# EasyEDA Pro project ProPrj_STC-FOC驱动_2026-02-01.epro

# Schematic Schematic1
Board Name: Board1; Create Date: 2026-01-31; Page Name: P1; Project Name: STC-FOC驱动; Schematic Name: Schematic1; Update Date: 2026-01-31; Company: 嘉立创EDA; Page Size: A4; Version: V1.0
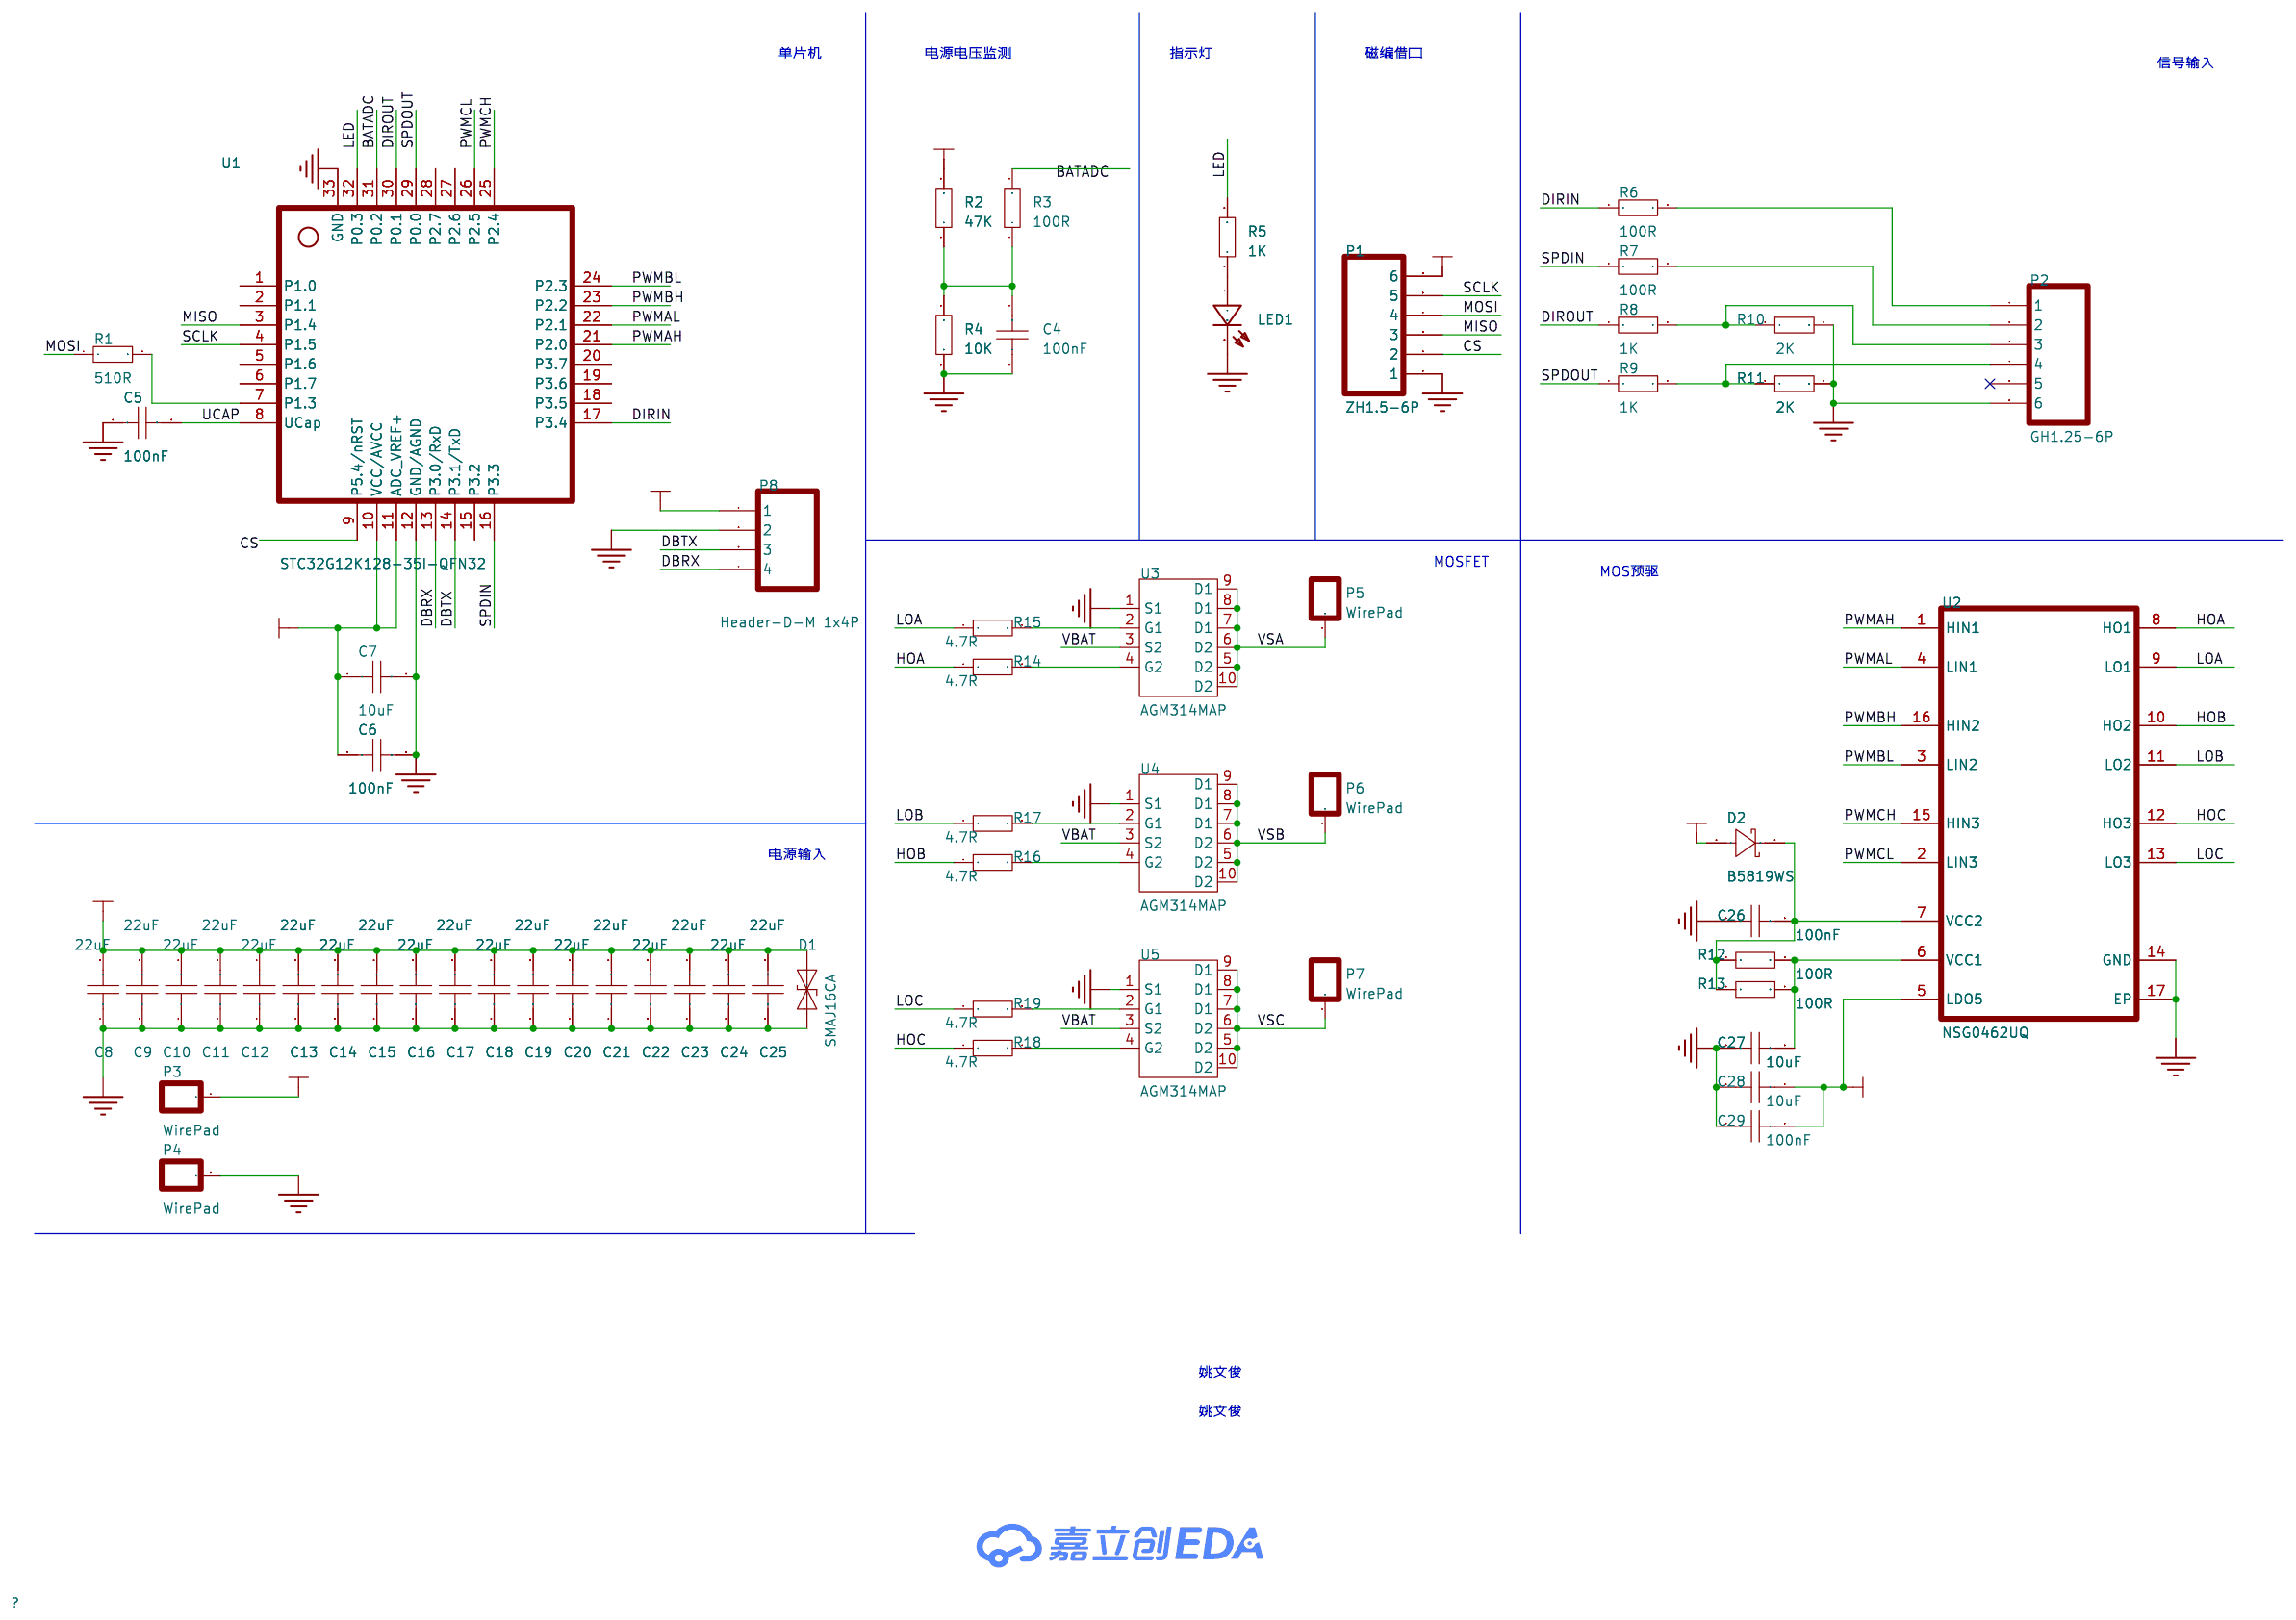
[diagram p0: schematic sheet]

## Parts
C4  100nF  [C0402]
C5  100nF  [C0402]
C6  100nF  [C0402]
C7  10uF  [C0603]
C8  22uF  [C0805]
C9  22uF  [C0805]
C10  22uF  [C0805]
C11  22uF  [C0805]
C12  22uF  [C0805]
C13  22uF  [C0805]
C14  22uF  [C0805]
C15  22uF  [C0805]
C16  22uF  [C0805]
C17  22uF  [C0805]
C18  22uF  [C0805]
C19  22uF  [C0805]
C20  22uF  [C0805]
C21  22uF  [C0805]
C22  22uF  [C0805]
C23  22uF  [C0805]
C24  22uF  [C0805]
C25  22uF  [C0805]
C26  100nF  [C0603]
C27  10uF  [C0603]
C28  10uF  [C0603]
C29  100nF  [C0402]
D1  SMAJ16CA  [SMA_L4.4-W2.6-LS5.0-BI]
D2  B5819WS  [SOD-323_L1.7-W1.3-LS2.7-RD]
LED1  LED Chip Blue  [LEDC1608(0603)-L]
P1  ZH1.5-6P  [ZH1.5-6P-SH]
P2  GH1.25-6P  [GH1.25-6P-SH]
P3  WirePad  [WirePad-3x4]
P4  WirePad  [WirePad-3x4]
P5  WirePad  [WirePad-3x4]
P6  WirePad  [WirePad-3x4]
P7  WirePad  [WirePad-3x4]
P8  Header-D-M 1x4P  [HDR1X4-M]
R1  510R  [R0402]
R2  47K  [R0402]
R3  100R  [R0402]
R4  10K  [R0402]
R5  1K  [R0402]
R6  100R  [R0402]
R7  100R  [R0402]
R8  1K  [R0402]
R9  1K  [R0402]
R10  2K  [R0402]
R11  2K  [R0402]
R12  100R  [R0603]
R13  100R  [R0603]
R14  4.7R  [R0402]
R15  4.7R  [R0402]
R16  4.7R  [R0402]
R17  4.7R  [R0402]
R18  4.7R  [R0402]
R19  4.7R  [R0402]
U1  STC32G12K128-35I-QFN32  [QFN32-4x4]
U2  NSG0462UQ  [QFN16-3x3-0.5]
U3  AGM314MAP  [PDFN-8_L3.2-W3.1-P0.65-LS3.4-BL-EP2]
U4  AGM314MAP  [PDFN-8_L3.2-W3.1-P0.65-LS3.4-BL-EP2]
U5  AGM314MAP  [PDFN-8_L3.2-W3.1-P0.65-LS3.4-BL-EP2]

## Library data of the parts
C4-C6 C29 = CAP_0402: Supplier Footprint: 0402
C7 C26-C28 = CAP_0603: Supplier Footprint: 0603
C8-C25 = CAP_0805: Supplier Footprint: 0805
D1 = SMAJ16CA: 极性:双向;反向截止电压(Vrwm):16V;钳位电压:26V;峰值脉冲电流(Ipp):15.38A;峰值脉冲功率(Ppp):400W@10/1000us;击穿电压:17.8V;; LCSC Part Name: 双向TVS 16V截止 峰值脉冲电流：15.38A; Supplier Part: C356365; Manufacturer: DOWO(东沃); Supplier Footprint: SMA(DO-214AC); JLCPCB Part Class: 扩展库; Datasheet: https://item.szlcsc.com/datasheet/SMAJ16CA/331563.html; Supplier: LCSC; Polarity: 双向; Reverse Stand-Off Voltage (Vrwm): 16V; Clamping Voltage: 26V; Peak Pulse Current (Ipp): 15.38A; Peak Pulse Power Dissipation (Ppp): 400W@10/1000us; Voltage - Breakdown: 17.8V; Reverse Leakage Current (Ir): 1uA; Operating Temperature: -55℃~+150℃; Type: TVS
D2 = B5819WS_C51953485: 二极管配置:1个独立式;正向压降(Vf):900mV@3A;直流反向耐压(Vr):40V;整流电流:1A;; LCSC Part Name: B5819WS 肖特基二极管 丝印SL 电流：1A 耐压：40V; Supplier Part: C51953485; Manufacturer: CCX(晁禾); Supplier Footprint: SOD-323; JLCPCB Part Class: 扩展库; Datasheet: https://item.szlcsc.com/datasheet/B5819WS/54682195.html; Supplier: LCSC; Diode Configuration: 1个独立式; Voltage - Forward(Vf@If): 900mV@3A; Voltage - DC Reverse(Vr): 40V; Current - Rectified: 1A; Reverse Leakage Current (Ir): 1mA@40V; Non-Repetitive Peak Forward Surge Current: 9A
LED1 = LED Chip Blue: 蓝色贴片LED; Published: 8-Jun-2000; Revision: July-2002: Re-released for DXP Platform.; Publisher: Altium Limited; Price(RMB): 0.00; Color: Blue; Footprint Name: LEDC3528-2
P1 = ZH1.5-6P: Revision: V1.0; Footprint Name: ZH1.5-6P-DV
P2 = GH1.25-6P: Revision: V1.0; Footprint Name: GH1.25-6P-SV
P3-P7 = WirePad: 线缆焊盘
P8 = Header-D-M 1x4P: 1x4pin, 直插, 排针; Revision: V1.0
R1-R11 R14-R19 = Res_0402: Supplier Footprint: 0402
R12 R13 = Res_0603: Supplier Footprint: 0603
U1 = STC32G12K128-35I-QFN32
U2 = NSG0462UQ: NSG0462UQ 三相栅极驱动器
U3-U5 = AGM314MAP: 数量:1个N沟道+1个P沟道;漏源电压(Vdss):30V;连续漏极电流(Id):30A；20A;导通电阻(RDS(on)):10mΩ@10V；18.5mΩ@10V;耗散功率(Pd):29.7W;阈值电压(Vgs(th)):1.6V@250uA；1.5V@250uA;; LCSC Part Name: 1个N沟道+1个P沟道 耐压:30V 电流:30A; Supplier Part: C17701056; Manufacturer: AGMSEMI(芯控源); Supplier Footprint: PDFN3.3x3.3-8; JLCPCB Part Class: 扩展库; Datasheet: https://item.szlcsc.com/datasheet/AGM314MAP/18831720.html; Supplier: LCSC; Number: 1个N沟道+1个P沟道; Drain to Source Voltage: 30V; Current - Continuous Drain(Id): 30A；20A; RDS(on): 10mΩ@10V；18.5mΩ@10V; Pd - Power Dissipation: 29.7W; Gate Threshold Voltage (Vgs(th)): 1.6V@250uA；1.5V@250uA; Gate Charge(Qg): 11.7nC@10V；13.2nC@10V; Input Capacitance(Ciss): 623pF；750pF; Reverse Transfer Capacitance (Crss@Vds): 91pF；117pF; Operating Temperature: -55℃~+150℃; Type: N沟道+P沟道; Output Capacitance(Coss): 102pF；188pF

## Nets
GND: C4.1 C5.1 C6.2 C7.2 C8.1 C9.1 C10.1 C11.1 C12.1 C13.1 C14.1 C15.1 C16.1 C17.1 C18.1 C19.1 C20.1 C21.1 C22.1 C23.1 C24.1 C25.1 C26.1 C27.1 C28.1 C29.1 D1.2(A) LED1.C P1.1 P2.6 P4.1 P8.2 R4.1 R10.2 R11.2 U1.12(GND/AGND) U1.33(GND) U2.14(GND) U2.17(EP) U3.1(S1) U4.1(S1) U5.1(S1)
VBAT: C8.2 C9.2 C10.2 C11.2 C12.2 C13.2 C14.2 C15.2 C16.2 C17.2 C18.2 C19.2 C20.2 C21.2 C22.2 C23.2 C24.2 C25.2 D1.1(K) D2.2(A) P3.1 R2.2 U3.3(S2) U4.3(S2) U5.3(S2)
VCCMCU: C6.1 C7.1 C28.2 C29.2 P1.6 P8.1 U1.10(VCC/AVCC) U1.11(ADC_VREF+) U2.5(LDO5)
BATADC: R3.2 U1.31(P0.2)
CS: P1.2 U1.9(P5.4/nRST)
DBRX: P8.4 U1.13(P3.0/RxD)
DBTX: P8.3 U1.14(P3.1/TxD)
DIRIN: R6.1 U1.17(P3.4)
DIROUT: R8.1 U1.30(P0.1)
HOA: R14.1 U2.8(HO1)
HOB: R16.1 U2.10(HO2)
HOC: R18.1 U2.12(HO3)
LED: R5.2 U1.32(P0.3)
LOA: R15.1 U2.9(LO1)
LOB: R17.1 U2.11(LO2)
LOC: R19.1 U2.13(LO3)
MISO: P1.3 U1.3(P1.4)
MOSI: P1.4 R1.1
PWMAH: U1.21(P2.0) U2.1(HIN1)
PWMAL: U1.22(P2.1) U2.4(LIN1)
PWMBH: U1.23(P2.2) U2.16(HIN2)
PWMBL: U1.24(P2.3) U2.3(LIN2)
PWMCH: U1.25(P2.4) U2.15(HIN3)
PWMCL: U1.26(P2.5) U2.2(LIN3)
SCLK: P1.5 U1.4(P1.5)
SPDIN: R7.1 U1.16(P3.3)
SPDOUT: R9.1 U1.29(P0.0)
UCAP: C5.2 U1.8(UCap)
VSA: P5.1 U3.5(D2) U3.6(D2) U3.7(D1) U3.8(D1) U3.9(D1) U3.10(D2)
VSB: P6.1 U4.5(D2) U4.6(D2) U4.7(D1) U4.8(D1) U4.9(D1) U4.10(D2)
VSC: P7.1 U5.5(D2) U5.6(D2) U5.7(D1) U5.8(D1) U5.9(D1) U5.10(D2)
$1N1197: R1.2 U1.7(P1.3)
$1N1744: C4.2 R2.1 R3.1 R4.2
$1N1936: LED1.A R5.1
$1N2404: P2.4 R9.2 R11.1
$1N2432: P2.3 R8.2 R10.1
$1N2453: P2.2 R7.2
$1N2459: P2.1 R6.2
$1N3795: C27.2 R12.2 R13.2 U2.6(VCC1)
$1N3801: C26.2 D2.1(K) R12.1 R13.1 U2.7(VCC2)
$1N6274: R15.2 U3.2(G1)
$1N6279: R14.2 U3.4(G2)
$1N6795: R17.2 U4.2(G1)
$1N6797: R16.2 U4.4(G2)
$1N6966: R19.2 U5.2(G1)
$1N6968: R18.2 U5.4(G2)

Not connected (* = marked no-connect by the designer): P2 5*; U1 1(P1.0) 2(P1.1) 5(P1.6) 6(P1.7) 15(P3.2) 18(P3.5) 19(P3.6) 20(P3.7) 27(P2.6) 28(P2.7)

## Notes on the sheet
- 单片机
- 电源电压监测
- 指示灯
- 磁编借口
- 信号输入
- MOSFET
- MOS预驱
- 电源输入
- 姚文俊
- 姚文俊

# Board PCB1
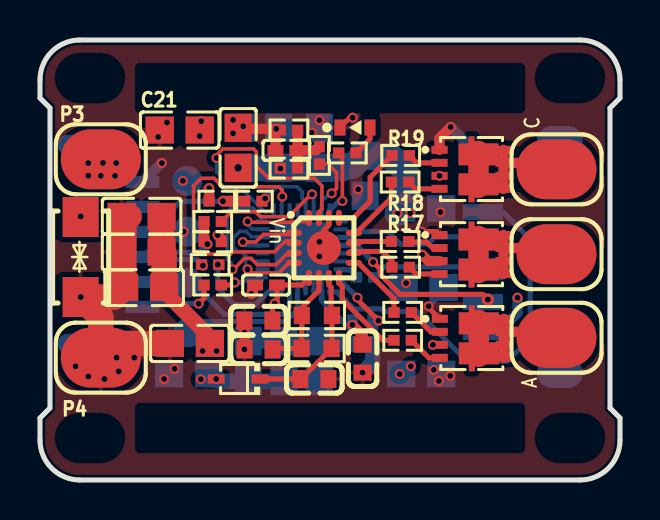
[diagram p1: board, top side]
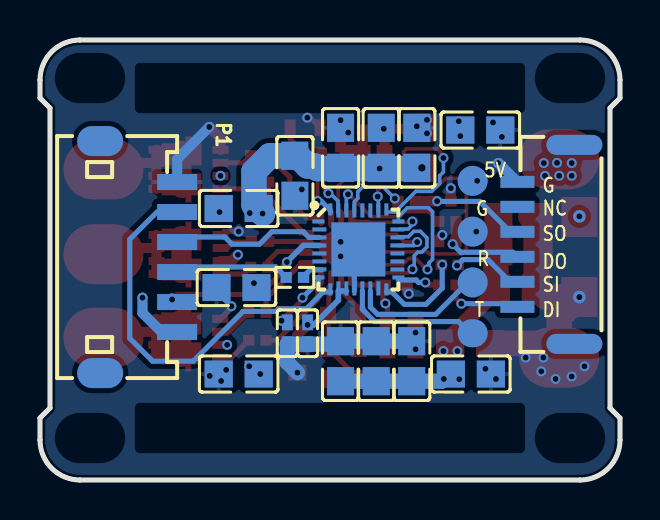
[diagram p2: board, bottom side, seen from below]

Outline 29 x 22 mm; copper layers: Top Layer, GND, VCC, Bottom Layer. Coordinates in mm from the lower left corner of the outline.
Outline path: 0,20 0,19.1 0.5,18.6 0.5,3.6 0,3.1 0,2 arc(0.59,0.59) 2,0 27,0 arc(28.41,0.59) 29,2 29,3.1 28.5,3.6 28.5,18.6 29,19.1 29,20 arc(28.41,21.41) 27,22 2,22 arc(0.59,21.41) 0,20
Stack: Top Layer 0.035mm 外层铜厚1oz / Dielectric1 0.2104mm 7628 RC49% 8.6mil / GND 0.0152mm 内层铜厚 / Dielectric2 1.065mm 1.1mm H/HOZ Copper / VCC 0.0152mm 内层铜厚 / Dielectric3 0.2104mm 7628 RC49% 8.6mil / Bottom Layer 0.035mm 外层铜厚1oz

## Design rules (mm)
template: JLCPCB Capability(Two Layers Board)
spacing copperThickness1oz (default): track to track 0.102, other pairs 0.152 to 0.3
spacing copperThickness2oz: track to track 0.203, other pairs 0.152 to 0.3
track width copperThickness1oz (default): min 0.127, default 0.254, max 2.54
track width copperThickness2oz: min 0.203, default 0.254, max 2.54
differential pair differentialPair (default): width min 0.127, default 0.254, max 2.54; gap min 0.152, default 0.152
via viaSize (default): diameter min 0.5, default 0.61, max 10; hole min 0.3, default 0.305, max 6.3

## Placement (name value [footprint] x y rotation side)
C4  100nF  [C0402]  12.32 16.48 0 top
C5  100nF  [C0402]  16.64 7.34 90 bottom
C6  100nF  [C0402]  15.62 7.34 270 bottom
C7  10uF  [C0603]  16.13 6.07 270 top
C8  22uF  [C0805]  19.06 5.3 180 bottom
C9  22uF  [C0805]  19.18 9.62 180 bottom
C10  22uF  [C0805]  16.26 15.21 90 bottom
C11  22uF  [C0805]  19.07 13.58 180 bottom
C12  22uF  [C0805]  13.97 5.94 270 bottom
C13  22uF  [C0805]  12.19 5.94 270 bottom
C14  22uF  [C0805]  10.41 5.94 270 bottom
C15  22uF  [C0805]  7.46 5.3 0 bottom
C16  22uF  [C0805]  13.97 16.61 270 bottom
C17  22uF  [C0805]  11.94 16.61 270 bottom
C18  22uF  [C0805]  10.16 16.61 270 bottom
C19  22uF  [C0805]  6.99 17.5 0 bottom
C20  22uF  [C0805]  7.49 6.83 0 top
C21  22uF  [C0805]  6.99 17.5 0 top
C22  22uF  [C0805]  9.91 16.61 270 top
C23  22uF  [C0805]  5.08 13.18 0 top
C24  22uF  [C0805]  5.08 11.4 0 top
C25  22uF  [C0805]  5.21 9.62 0 top
C26  100nF  [C0603]  13.72 5.05 180 top
C27  10uF  [C0603]  10.93 6.53 0 top
C28  10uF  [C0603]  10.92 7.97 0 top
C29  100nF  [C0402]  11.3 9.75 0 top
D1  SMAJ16CA  [SMA_L4.4-W2.6-LS5.0-BI]  2.03 11.15 270 top
D2  B5819WS  [SOD-323_L1.7-W1.3-LS2.7-RD]  9.91 5.05 180 top
LED1  LED Chip Blue  [LEDC1608(0603)-L]  15.75 17.62 0 top
P1  ZH1.5-6P  [ZH1.5-6P-SH]  24.89 11.15 270 bottom
P2  GH1.25-6P  [GH1.25-6P-SH]  3.43 11.78 90 bottom
P3  WirePad  [WirePad-3x4]  3.04 16.04 0 top
P4  WirePad  [WirePad-3x4]  3.04 6.12 0 top
P5  WirePad  [WirePad-3x4]  25.83 7.11 0 top
P6  WirePad  [WirePad-3x4]  25.83 11.29 0 top
P7  WirePad  [WirePad-3x4]  25.83 15.53 0 top
P8  Header-D-M 1x4P  [HDR1X4-M]  7.37 14.96 270 bottom
R1  510R  [R0402]  16.26 10.13 180 bottom
R2  47K  [R0402]  12.45 15.59 180 top
R3  100R  [R0402]  13.97 16.23 270 top
R4  10K  [R0402]  12.45 17.5 0 top
R5  1K  [R0402]  15.37 16.35 180 top
R6  100R  [R0402]  8.64 9.75 180 top
R7  100R  [R0402]  8.51 10.77 180 top
R8  1K  [R0402]  8.64 12.93 180 top
R9  1K  [R0402]  10.67 13.94 180 top
R10  2K  [R0402]  8.64 11.91 0 top
R11  2K  [R0402]  8.89 13.94 180 top
R12  100R  [R0603]  13.83 6.58 180 top
R13  100R  [R0603]  13.84 8.23 180 top
R14  4.7R  [R0402]  18.13 6.99 0 top
R15  4.7R  [R0402]  18.13 8.38 0 top
R16  4.7R  [R0402]  18.03 10.64 0 top
R17  4.7R  [R0402]  18.01 11.92 0 top
R18  4.7R  [R0402]  18.01 14.9 0 top
R19  4.7R  [R0402]  18.03 16.23 0 top
U1  STC32G12K128-35I-QFN32  [QFN32-4x4]  13.08 11.53 180 bottom
U2  NSG0462UQ  [QFN16-3x3-0.5]  14.2 11.61 0 top
U3  AGM314MAP  [PDFN-8_L3.2-W3.1-P0.65-LS3.4-BL-EP2]  21.59 7.08 270 top
U4  AGM314MAP  [PDFN-8_L3.2-W3.1-P0.65-LS3.4-BL-EP2]  21.58 11.27 270 top
U5  AGM314MAP  [PDFN-8_L3.2-W3.1-P0.65-LS3.4-BL-EP2]  21.58 15.53 270 top

## Footprints (pads in the part's own frame, mm; a bottom-side part is the same pattern mirrored in y, then rotated)
C0402
  rect 0.79x0.54 smd: 1(-0.545,0) 2(0.545,0)
C0603
  rect 0.8x0.9 smd: 1(-0.7,0) 2(0.7,0)
C0805
  rect 1.41x1.35 smd: 1(-1,0) 2(1,0)
GH1.25-6P-SH
  oval 1x2.8 smd: 0(-4.975,-1.15) 0(4.975,-1.15)
  rect 0.6x1.7 smd: 1(-3.125,1.7) 2(-1.875,1.7) 3(-0.625,1.7) 4(0.625,1.7) 5(1.875,1.7) 6(3.125,1.7)
HDR1X4-M
  round 1.5 smd: 1(0,0) 2(2.54,0) 3(5.08,0)
  oval 1.4x1.5 smd: 4(7.62,0)
LEDC1608(0603)-L
  rect 0.55x0.8 smd: A(0.75,0) C(-0.75,0)
PDFN-8_L3.2-W3.1-P0.65-LS3.4-BL-EP2
  rect 0.4x0.8 smd: 1(-0.975,-1.6) 2(-0.325,-1.6) 3(0.325,-1.6) 4(0.975,-1.6) 5(0.975,1.6) 6(0.325,1.6) 7(-0.325,1.6) 8(-0.975,1.6)
  custom 1.45x2 smd: 9(-0.925,0.35) 10(0.925,0.35)
QFN16-3x3-0.5
  oval 0.8x0.3 smd: 1(-1.5,0.75) 2(-1.5,0.25) 3(-1.5,-0.25) 4(-1.5,-0.75) 9(1.5,-0.75) 10(1.5,-0.25) 11(1.5,0.25) 12(1.5,0.75)
  oval 0.3x0.8 smd: 5(-0.75,-1.5) 6(-0.25,-1.5) 7(0.25,-1.5) 8(0.75,-1.5) 13(0.75,1.5) 14(0.25,1.5) 15(-0.25,1.5) 16(-0.75,1.5)
  round 1.7 smd: 17(0,0)
QFN32-4x4
  rect 0.6x0.2 smd: 1(-2,1.4) 8(-2,-1.4) 17(2,-1.4) 24(2,1.4)
  rect 0.7x0.2 smd: 2(-1.95,1) 3(-1.95,0.6) 4(-1.95,0.2) 5(-1.95,-0.2) 6(-1.95,-0.6) 7(-1.95,-1) 18(1.95,-1) 19(1.95,-0.6) 20(1.95,-0.2) 21(1.95,0.2) 22(1.95,0.6) 23(1.95,1)
  rect 0.2x0.6 smd: 9(-1.4,-2) 16(1.4,-2) 25(1.4,2) 32(-1.4,2)
  rect 0.2x0.7 smd: 10(-1,-1.95) 11(-0.6,-1.95) 12(-0.2,-1.95) 13(0.2,-1.95) 14(0.6,-1.95) 15(1,-1.95) 26(1,1.95) 27(0.6,1.95) 28(0.2,1.95) 29(-0.2,1.95) 30(-0.6,1.95) 31(-1,1.95)
  rect 2.7x2.7 smd: 33(0,0)
R0402
  rect 0.566x0.54 smd: 1(-0.433,0) 2(0.433,0)
R0603
  rect 0.806x0.864 smd: 1(-0.753,0) 2(0.753,0)
SMA_L4.4-W2.6-LS5.0-BI
  rect 2x1.8 smd: 1(-2,0) 2(2,0)
SOD-323_L1.7-W1.3-LS2.7-RD
  rect 0.845x0.455 smd: 1(-1.097,0) 2(1.097,0)
WirePad-3x4
  oval 4x3 smd: 1(0,0)
ZH1.5-6P-SH
  oval 1.5x2.3 smd: 0(-5.8,-1.1) 0(5.8,-1.1)
  rect 0.8x2 smd: 1(-3.75,2.75) 2(-2.25,2.75) 3(-0.75,2.75) 4(0.75,2.75) 5(2.25,2.75) 6(3.75,2.75)

## Nets
As in the schematic.

Pads without a net: P1 0; P2 0 5; U1 1 2 5 6 15 18 19 20 27 28

## Via types
v1: diameter 0.5, hole 0.3, Top Layer to Bottom Layer, 71 vias
v2: diameter 0.635, hole 0.305, Top Layer to Bottom Layer, 2 vias
v3: diameter 0.5, hole 0.305, Top Layer to Bottom Layer, 8 vias
v4: diameter 0.61, hole 0.305, Top Layer to Bottom Layer, 1 via
v5: diameter 0.635, hole 0.381, Top Layer to Bottom Layer, 1 via

## Routing (per net, layer and track width the routed paths; a pad name or vN(x,y) marks a point on that pad's centre or on a via; arc(x,y) is an arc through that point)
GND: length 40.4
  Top Layer w0.254: v1(19.07,12.42) 19.8,12.42 U4.1 ; U3.1 19.43,8.62 v1(19.43,8.69) ; U2.17 14.2,12.5 14.45,12.75 U2.14 ; LED1.C 15.49,18.12 v1(15.63,18.12)
  Top Layer w0.508: C22.1 9.96,17.56 v1(11.81,17.56) 11.77,17.52 C4.1 ; R10.2 9.07,12.06 8.89,12.24 ; 10.64,9.75 10.64,9.38 v1(10.56,9.31) ; v1(20.54,17.65) 19.98,17.09 U5.1 ; C27.1 v1(10.22,6.54) v1(10.22,7.37) C28.1 ; 8.46,13.94 v1(8.46,14.59)
  Top Layer w1.27: C20.1 4.06,6.83 3.56,6.32 ; 4.46,13.18 4.19,13.18 4.19,9.62 3.72,9.15 v2(2.03,9.15) 3.04,8.14 P4.1
  Bottom Layer w0.254: 13.28,9.45 13.28,11.2 13.08,11.4 ; C9.1 20.18,9.44 v1(19.43,8.69)
  Bottom Layer w0.508: P1.1 22.14,16.05 v1(20.54,17.65) ; P2.6 6.07,15.85 v1(6.1,15.85)
  Bottom Layer w0.762: v1(16.13,5.37) 16.64,5.88 C5.1 C6.2 14.12,6.79 C12.1 C13.1 C14.1
  vias: v1(1.78,5.69) v1(2.41,5.18) v1(3.22,5.05) v1(3.83,6.12) v1(3.94,5.43) v1(4.72,6.12) v1(5.91,17.15) v1(6.2,5.05) v1(6.35,17.88) v1(6.73,5.56) v1(7.19,12.42) v1(8.88,12.25) v1(9.65,18.01) v1(9.65,17.33) v1(10.16,17.69) v1(13.59,17.37) v1(13.97,17.99) v1(13.97,11.91) v1(13.97,11.18) v1(15.91,14.53) v1(19.69,5.51) v1(19.94,4.95) v1(20.02,13.39) v1(20.51,5.21)
VBAT: length 24.6
  Top Layer w0.178: v1(19.64,6.76) U3.3
  Top Layer w0.508: U4.3 19.42,10.95 v1(19.1,11.27)
  Top Layer w0.762: C20.2 8.49,7.15 6.21,9.44
  Top Layer w1.27: C25.2 6.21,11.27 C24.2 C23.2
  Bottom Layer w0.762: C12.2 C13.2 C14.2 8.92,4.94 v1(8.81,5.05)
  Bottom Layer w1.27: 10.29,15.61 10.32,15.57 v1(12.02,15.57) 15.12,15.57 15.25,15.7 15.62,15.7 16.13,16.21 17.51,16.21 18.3,15.42 18.3,13.75 v1(17.87,13.32)
  vias: v1(2.41,15.85) v1(2.41,15.21) v1(3.04,15.21) v1(3.15,15.86) v1(3.81,15.85) v1(3.75,15.21) v1(7.99,17.2) v1(8.04,5.04) v1(8.06,17.94) v1(8.13,6.45) v1(8.83,6.45) v1(17.99,5.3) v1(18.3,9.84) v1(18.51,13.35) v1(18.54,5.69) v1(19.98,15.21) v2(2.03,13.18) v5(9.91,15.61)
VCCMCU: length 10.6
  Top Layer w0.254: 11.86,9.75 13.09,9.75 U2.5 ; 11.86,9.75 11.86,8.95 v1(11.73,8.83) 11.62,8.72 11.62,7.99 11.61,7.98 C28.2 ; 11.86,9.75 C29.2
  Top Layer w0.508: v1(15.62,7.76) 16.13,7.25 C7.1
  Bottom Layer w0.28: 13.68,9.45 14.08,9.45 14.08,8.99 15.32,7.75 15.61,7.75 v1(15.62,7.76)
  Bottom Layer w0.508: P1.6 22.92,7.4 23.88,8.35 v1(23.88,9.12)
  vias: v1(7.14,14.96)
BATADC: length 3.4
  Top Layer w0.178: R3.2 14.4,15.79 14.83,15.37 14.83,14.58 v1(14.58,14.33)
  Bottom Layer w0.178: 14.08,13.35 14.1,13.37 14.1,13.95 14.49,14.33 v1(14.58,14.33)
CS: length 19.8
  Bottom Layer w0.254: 14.46,9.4 14.84,9.4 15.69,8.56 17.08,8.56 17.21,8.43 18.85,8.43 21.34,5.94 23.37,5.94 24.51,7.08 24.51,12.04 23.15,13.4 P1.2
DBRX: length 6.9
  Bottom Layer w0.254: 7.37,7.34 7.49,7.34 8.08,7.92 12.27,7.92 12.88,8.53 12.88,9.45
DBTX: length 6.7
  Bottom Layer w0.254: 12.48,9.45 12.48,8.64 12.12,8.28 9.22,8.28 7.62,9.88 P8.3
DIRIN: length 2.1
  Top Layer w0.254: R6.1 9.61,9.75 v3(9.73,9.88)
  Bottom Layer w0.254: 11.08,10 10.19,10 10.07,9.88 v3(9.73,9.88)
DIROUT: length 6.3
  Top Layer w0.178: R8.1 9.09,12.93 9.58,13.42 10.76,13.42 11.02,13.17 12.43,13.17 13.58,14.31 v1(13.6,14.29)
  Bottom Layer w0.178: v1(13.6,14.29) 13.68,14.21 13.68,13.35
HOA: length 4.3
  Top Layer w0.254: R14.1 17.16,6.99 15.11,9.03 15.11,9.68 14.99,9.81
HOB: length 2.7
  Top Layer w0.254: 15.44,11.36 15.51,11.43 17.12,11.43 17.6,10.95 R16.1
HOC: length 3.6
  Top Layer w0.254: 15.44,12.36 15.81,12.36 17.57,14.12 R18.1
LED: length 3.4
  Top Layer w0.178: 15,16.29 15.12,16.17 v1(15.12,13.95)
  Top Layer w0.254: R5.2 15,16.29
  Bottom Layer w0.254: v1(15.12,13.95) 14.95,13.95 14.48,13.48 14.48,13.4
LOA: length 3.7
  Top Layer w0.254: 15.44,10.86 15.91,10.86 17.7,9.07 R15.1
LOB: length 2.2
  Top Layer w0.254: 17.57,11.93 15.51,11.93 15.44,11.86
LOC: length 4.6
  Top Layer w0.254: R19.1 16.51,15.14 16.51,13.94 15.67,13.11 U2.13
MISO: length 7.7
  Bottom Layer w0.254: 15.03,12.13 15.55,12.13 15.84,12.42 17.4,12.42 18.02,11.79 19.4,11.79 19.76,12.15 21.89,12.15 P1.3
MOSI: length 5.8
  Bottom Layer w0.254: R1.1 17.21,10.65 21.89,10.65 P1.4
PWMAH: length 3.8
  Top Layer w0.178: v1(10.14,11.9) 10.78,11.9 11.16,12.28 12.62,12.28 U2.1
  Bottom Layer w0.178: 11.11,11.72 10.32,11.72 v1(10.14,11.9)
PWMAL: length 6.1
  Top Layer w0.178: v1(10.38,10.54) 10.56,10.35 11.94,10.35 12.44,10.86
  Bottom Layer w0.178: U1.22 11.1,12.16 10.58,12.16 10.31,12.43 9.98,12.43 9.65,12.1 9.65,11.66 9.92,11.39 10.11,11.39 10.29,11.22 10.29,10.63 v1(10.38,10.54)
PWMBH: length 4
  Top Layer w0.178: 13.41,13.11 13.23,12.93 12.59,12.93 12.55,12.89 10.42,12.89 v3(10.38,12.93)
  Bottom Layer w0.178: 10.99,12.54 10.6,12.54 10.41,12.73 10.41,12.89 v3(10.38,12.93)
PWMBL: length 8.9
  Top Layer w0.178: U2.3 12.59,11.25 12.28,11.25 11.8,10.77 10.87,10.77 10.56,11.08 10.22,11.08 9.67,10.53 v1(9.63,10.53)
  Bottom Layer w0.178: v1(9.63,10.53) 9.55,10.61 9.55,10.86 9.37,11.03 9.37,13.41 9.57,13.61 10.63,13.61 11.08,13.16 U1.24
PWMCH: length 13
  Top Layer w0.178: U2.15 13.97,13.13 13.97,13.43 14.09,13.55 14.09,14.71 13.72,15.08 13.26,15.08 13.26,15.08 11.63,15.08 11.63,15.08 11.43,15.08 10.82,15.69 10.82,16.41 10.68,16.55 9.13,16.55 8.83,16.25 v1(8.83,16.1)
  Bottom Layer w0.178: 11.68,13.4 11.24,13.4 10.21,14.43 9.41,14.43 9.02,14.83 9.02,15.21 8.83,15.4 v1(8.83,16.1)
PWMCL: length 14.6
  Top Layer w0.178: 12.69,11.86 12.58,11.96 12.28,11.96 11.72,11.41 9.64,11.41 9.53,11.3 7.91,11.3 7.68,11.54 7.68,14.71 8.05,15.08 8.71,15.08 9.13,14.66 11.94,14.66 12.11,14.48 v1(12.11,14.17)
  Bottom Layer w0.178: v1(12.11,14.17) 12.08,14.14 12.08,13.35
SCLK: length 8.6
  Top Layer w0.254: v4(22.4,9.02) 22.14,9.28 18.01,9.28 17.04,10.25 17.04,10.51 v1(16.66,10.9)
  Bottom Layer w0.28: 15.03,11.73 15.83,11.73 v1(16.66,10.9)
SPDIN: length 4.6
  Bottom Layer w0.254: 11.68,9.4 11.4,9.4 10.78,8.78 9.7,8.78 8.89,9.59 v3(8.89,10.77)
SPDOUT: length 3.3
  Bottom Layer w0.178: v1(11.26,14.08) 11.84,14.66 12.86,14.66 13.11,14.41 13.11,14.08 13.28,13.91 13.28,13.35
UCAP: length 3.2
  Top Layer w0.254: v3(15.88,9.12) 15.88,9.01 v3(16.92,7.97)
  Bottom Layer w0.254: v3(15.88,9.12) 15.08,9.91 U1.8 ; v3(16.92,7.97) 16.84,7.88 C5.2
VSA: length 6.6
  Top Layer w0.508: U3.7 25.53,7.41 P5.1 ; U3.7 U3.8 ; U3.7 U3.6 U3.5
  Top Layer w1.016: U3.9 U3.10
VSB: length 6.6
  Top Layer w0.508: U4.8 U4.7 ; U4.7 U4.6 23.18,10.3 ; U4.7 25.52,11.6 P6.1
  Top Layer w1.016: U4.9 U4.10
VSC: length 6.6
  Top Layer w0.508: P7.1 25.5,15.86 U5.7 ; U5.7 U5.6 U5.5 ; U5.7 U5.8
  Top Layer w1.016: U5.9 U5.10
$1N1197: length 1.1
  Bottom Layer w0.254: 14.92,10.51 15.5,10.51 15.66,10.34 15.66,10.29 R1.2
$1N1744: length 2.9
  Top Layer w0.508: R3.1 13.81,16.5 12.88,16.5 R4.2 ; 12.86,15.72 C4.2
$1N1936: length 1.3
  Top Layer w0.254: 16.5,17.37 16.5,17.05 R5.1
$1N2404: length 5.7
  Top Layer w0.508: R9.2 v3(9.15,13.94)
  Bottom Layer w0.254: v3(9.15,13.94) 9.13,13.93 7.01,13.93 5.49,12.41 P2.4
$1N2432: length 4.6
  Top Layer w0.508: v3(8.37,11.79) 8.2,11.96 8.2,12.8
  Bottom Layer w0.254: v3(8.37,11.79) 7.96,11.39 5.36,11.39 P2.3
$1N2453: length 3.6
  Bottom Layer w0.254: v1(8.15,10.72) 7.85,11.02 6.6,11.02 5.62,10.03 5.26,10.03 P2.2
$1N2459: length 3.9
  Top Layer w0.254: R6.2 8.2,9.09 v3(7.93,8.82)
  Bottom Layer w0.254: v3(7.93,8.82) 5.29,8.82 P2.1
$1N3795: length 5.4
  Top Layer w0.254: C27.2 11.68,6.58 R12.2 13.09,6.59 13.09,8.23 13.14,8.28 13.14,8.67 13.95,9.47 U2.6
$1N3801: length 7.8
  Top Layer w0.254: U2.7 14.45,9.75 14.55,9.64 14.55,8.27 14.6,8.23 14.6,6.59 R12.1 13.06,5.05 D2.1
$1N6274: length 1.8
  Top Layer w0.254: U3.2 19.54,7.41 R15.2
$1N6279: length 1.8
  Top Layer w0.254: R14.2 19.44,6.11 U3.4
$1N6795: length 1.7
  Top Layer w0.254: R17.2 18.47,11.89 19.34,11.89 19.63,11.6 U4.2
$1N6797: length 1.6
  Top Layer w0.254: 18.47,10.64 18.81,10.3 19.98,10.3
$1N6966: length 1.7
  Top Layer w0.254: 19.98,15.86 18.84,15.86 18.47,16.23
$1N6968: length 1.7
  Top Layer w0.254: U5.4 18.78,14.56 R18.2

## Copper pours and planes (outline as drawn; the poured copper is in the pictures)
GND on Top Layer: -4.44,24.1 31.12,24.1 31.12,-4.6 -4.44,-4.6
GND on Bottom Layer: -3.68,26.39 31.37,26.39 31.37,-6.25 -3.68,-6.25
GND on GND: 0.26,21.74 28.74,21.74 28.74,0.26 0.26,0.26
VBAT on VCC: 21.72,8.73 21.84,8.86 21.84,18.39 21.72,18.51 0,18.51 0,3.72 21.82,3.72 21.82,7.09 19.02,7.09 19.02,5.96 10.9,5.96 7.37,9.5 7.37,12.75 5.59,15.08 7.18,16.67 9.41,14.43 16.65,14.43 16.76,14.32 16.76,8.73
VCCMCU on VCC: 9.33,10.77 7.69,12.93 6.1,15.09 7.23,16.21 9.41,14.43 16.17,8.38 23.53,8.38 23.53,10 25.01,10 25.01,7.21 17.14,7.21 17.14,6.32 11.98,6.32

## Text on the board
Bottom Silkscreen Layer: G | NC | SO | DO | SI | DI | 5V | R | T
Top Silkscreen Layer: A | C | Vin
